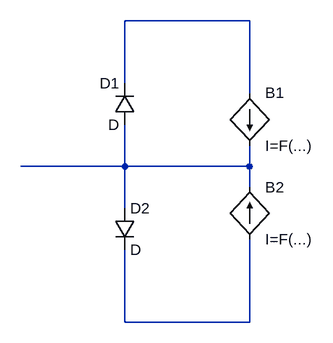
[diagram p0: schematic Draft3.asc]
Draft3.asc, the LTspice schematic file:
Version 4
SHEET 1 880 680
WIRE 304 -16 112 -16
WIRE 112 80 112 -16
WIRE 304 96 304 -16
WIRE 112 208 112 144
WIRE 112 208 -48 208
WIRE 304 208 304 176
WIRE 304 208 112 208
WIRE 304 240 304 208
WIRE 112 272 112 208
WIRE 112 448 112 336
WIRE 304 448 304 320
WIRE 304 448 112 448
SYMBOL diode 128 144 R180
WINDOW 0 24 64 Left 2
WINDOW 3 24 0 Left 2
SYMATTR InstName D1
SYMBOL diode 96 272 R0
SYMATTR InstName D2
SYMBOL bi2 304 176 M180
WINDOW 0 24 81 Left 2
WINDOW 3 24 0 Left 2
SYMATTR InstName B1
SYMBOL bi2 304 240 R0
SYMATTR InstName B2

The netlist it stands for:
* Draft3.asc
D1 N002 N001 D
D2 N002 N003 D
B1 N001 N002 I=F(...)
B2 N003 N002 I=F(...)
.model D D
.lib standard.dio
.backanno
.end